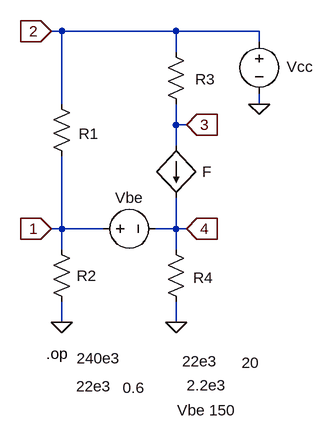
[diagram p0: schematic BJT_CE_amp_Ebers-Moll_model.asc]
BJT_CE_amp_Ebers-Moll_model.asc, the LTspice schematic file:
Version 4
SHEET 1 880 680
WIRE -48 -160 -64 -160
WIRE 128 -160 -48 -160
WIRE 256 -160 128 -160
WIRE 256 -144 256 -160
WIRE 128 -128 128 -160
WIRE -48 -48 -48 -160
WIRE 256 -48 256 -64
WIRE 128 -16 128 -48
WIRE 144 -16 128 -16
WIRE 128 16 128 -16
WIRE -48 144 -48 32
WIRE -48 144 -64 144
WIRE 16 144 -48 144
WIRE 128 144 128 96
WIRE 128 144 96 144
WIRE 144 144 128 144
WIRE -48 176 -48 144
WIRE 128 176 128 144
WIRE -48 288 -48 256
WIRE 128 288 128 256
FLAG 256 -48 0
FLAG 128 288 0
FLAG -48 288 0
FLAG -64 144 1
IOPIN -64 144 In
FLAG 144 -16 3
IOPIN 144 -16 In
FLAG 144 144 4
IOPIN 144 144 In
FLAG -64 -160 2
IOPIN -64 -160 In
SYMBOL res -64 -64 R0
WINDOW 0 42 62 Left 2
WINDOW 3 39 407 Left 2
SYMATTR InstName R1
SYMATTR Value 240e3
SYMBOL res -64 160 R0
WINDOW 0 39 56 Left 2
WINDOW 3 38 226 Left 2
SYMATTR InstName R2
SYMATTR Value 22e3
SYMBOL res 112 160 R0
WINDOW 0 42 59 Left 2
WINDOW 3 32 225 Left 2
SYMATTR InstName R4
SYMATTR Value 2.2e3
SYMBOL res 112 -144 R0
WINDOW 0 45 58 Left 2
WINDOW 3 25 492 Left 2
SYMATTR InstName R3
SYMATTR Value 22e3
SYMBOL voltage 256 -160 R0
WINDOW 0 42 55 Left 2
WINDOW 3 -27 510 Left 2
SYMATTR InstName Vcc
SYMATTR Value 20
SYMBOL voltage 0 144 R270
WINDOW 0 32 56 VTop 2
WINDOW 3 -229 63 VBottom 2
SYMATTR InstName Vbe
SYMATTR Value 0.6
SYMBOL f 128 16 R0
WINDOW 0 40 40 Left 2
WINDOW 3 2 407 Left 2
SYMATTR InstName F
SYMATTR Value Vbe 150
TEXT -72 336 Left 2 !.op

The netlist it stands for:
* BJT_CE_amp_Ebers-Moll_model.asc
R1 2 1 240e3
R2 1 0 22e3
R4 4 0 2.2e3
R3 2 3 22e3
Vcc 2 0 20
Vbe 1 4 0.6
F 3 4 Vbe 150
.op
.backanno
.end